# Altium schematic sheet power-connectors.SchDoc
size A4
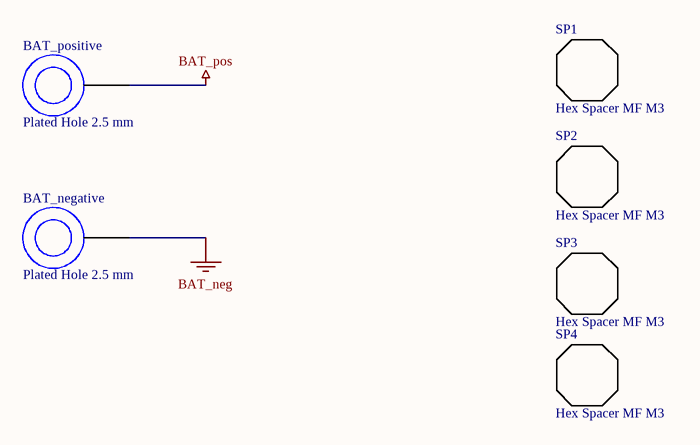
[diagram p0: power-connectors.SchDoc]

## Parts
BAT_negative  Plated Hole 2.5 mm  [Plated Hole 2.5mm]
BAT_positive  Plated Hole 2.5 mm  [Plated Hole 2.5mm]
SP1  Hex Spacer MF M3  [Hex Spacer MF M3 L30mm]
SP2  Hex Spacer MF M3  [Hex Spacer MF M3 L30mm]
SP3  Hex Spacer MF M3  [Hex Spacer MF M3 L30mm]
SP4  Hex Spacer MF M3  [Hex Spacer MF M3 L30mm]

## Nets
BAT_neg: BAT_negative.1
BAT_pos: BAT_positive.1